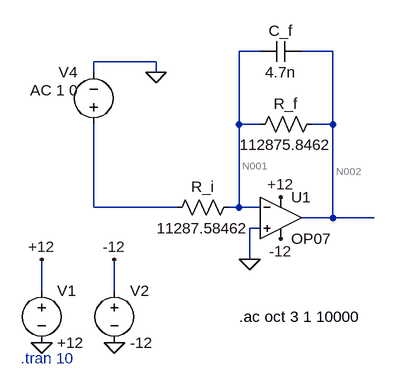
[diagram p0: schematic Low pass.asc]
Low pass.asc, the LTspice schematic file:
Version 4.1
SHEET 1 880 680
WIRE 176 -96 144 -96
WIRE 288 -96 240 -96
WIRE 16 -80 -80 -80
WIRE -80 -64 -80 -80
WIRE 16 -64 16 -80
WIRE 144 16 144 -96
WIRE 176 16 144 16
WIRE 288 16 288 -96
WIRE 288 16 256 16
WIRE -80 144 -80 16
WIRE 48 144 -80 144
WIRE 144 144 144 16
WIRE 144 144 128 144
WIRE 176 144 144 144
WIRE 288 160 288 16
WIRE 288 160 240 160
WIRE 352 160 288 160
WIRE 176 176 160 176
WIRE 160 224 160 176
WIRE -160 272 -160 224
WIRE -48 272 -48 224
FLAG 160 224 0
FLAG -160 352 0
FLAG -48 352 0
FLAG 208 128 +12
FLAG -48 224 -12
FLAG 208 192 -12
FLAG -160 224 +12
FLAG 16 -64 0
SYMBOL OpAmps\\OP07 208 96 R0
SYMATTR InstName U1
SYMBOL res 144 128 R90
WINDOW 0 0 56 VBottom 2
WINDOW 3 32 56 VTop 2
SYMATTR InstName R_i
SYMATTR Value 11287.58462
SYMBOL res 272 0 R90
WINDOW 0 0 56 VBottom 2
WINDOW 3 32 56 VTop 2
SYMATTR InstName R_f
SYMATTR Value 112875.8462
SYMBOL cap 240 -112 R90
WINDOW 0 0 32 VBottom 2
WINDOW 3 32 32 VTop 2
SYMATTR InstName C_f
SYMATTR Value 4.7n
SYMBOL voltage -160 256 R0
WINDOW 123 0 0 Left 0
WINDOW 39 0 0 Left 0
SYMATTR InstName V1
SYMATTR Value +12
SYMBOL voltage -48 256 R0
WINDOW 123 0 0 Left 0
WINDOW 39 0 0 Left 0
SYMATTR InstName V2
SYMATTR Value -12
SYMBOL voltage -80 32 R180
WINDOW 0 24 96 Left 2
WINDOW 3 24 16 Left 2
WINDOW 123 24 68 Left 2
WINDOW 39 0 0 Left 0
SYMATTR InstName V4
SYMATTR Value ""
SYMATTR Value2 AC 1 0
TEXT -192 376 Left 2 ;.tran 10
TEXT 144 312 Left 2 !.ac oct 3 1 10000

The netlist it stands for:
* Low pass.asc
X§U1 0 N001 +12 -12 N002 LT1001  ; OP07, pins In+ In- V+ V- OUT
R_i N001 N003 11287.58462
R_f N002 N001 112875.8462
C_f N002 N001 4.7n
V1 +12 0 +12
V2 -12 0 -12
V4 N003 0 AC 1 0
* .tran 10
.ac oct 3 1 10000
.lib LTC.lib
.backanno
.end

* Results of the author's LTspice run, read from the files saved beside the schematic
* Operating Point, zero values left out:
*   V(+12) = 12 V
*   V(-12) = -12 V
*   I(V1) = -2.25 mA
*   I(V2) = 2.25 mA
*   Ix(u1:3) = 2.25 mA
*   Ix(u1:4) = -2.25 mA
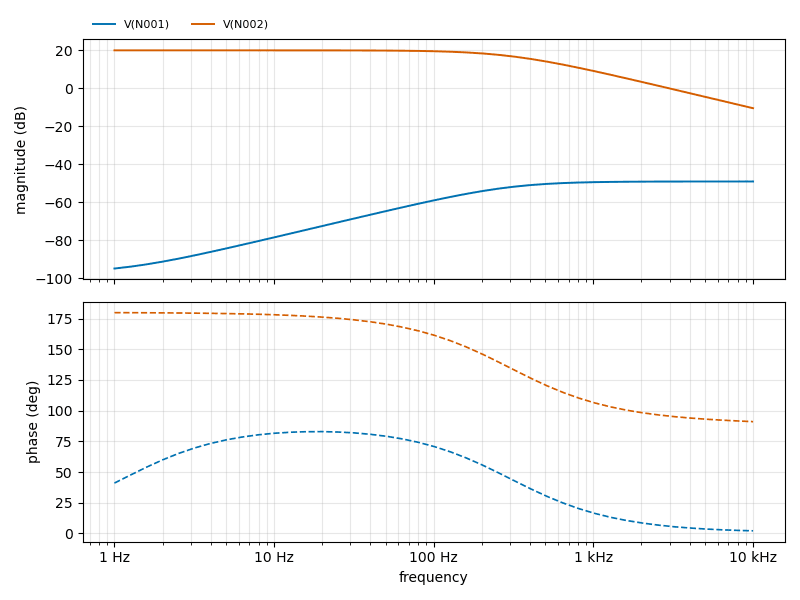
[diagram p1: AC Analysis of Low pass.asc, plotted from the saved traces]
* AC Analysis, 1 run:
*   V(N001): -94.99 dB at 1 Hz, -49.10 dB at 10 kHz, peak -49.10 dB at 10 kHz, 3 dB below the peak at 300.4 Hz
*   V(N002): 20.00 dB at 1 Hz, -10.49 dB at 10 kHz, peak 20.00 dB at 1 Hz, 3 dB below the peak at 297.1 Hz